# Altium schematic sheet OurEDA-P1K_Network.SchDoc
size A4; SheetNumber: 2; SheetTotal: 7
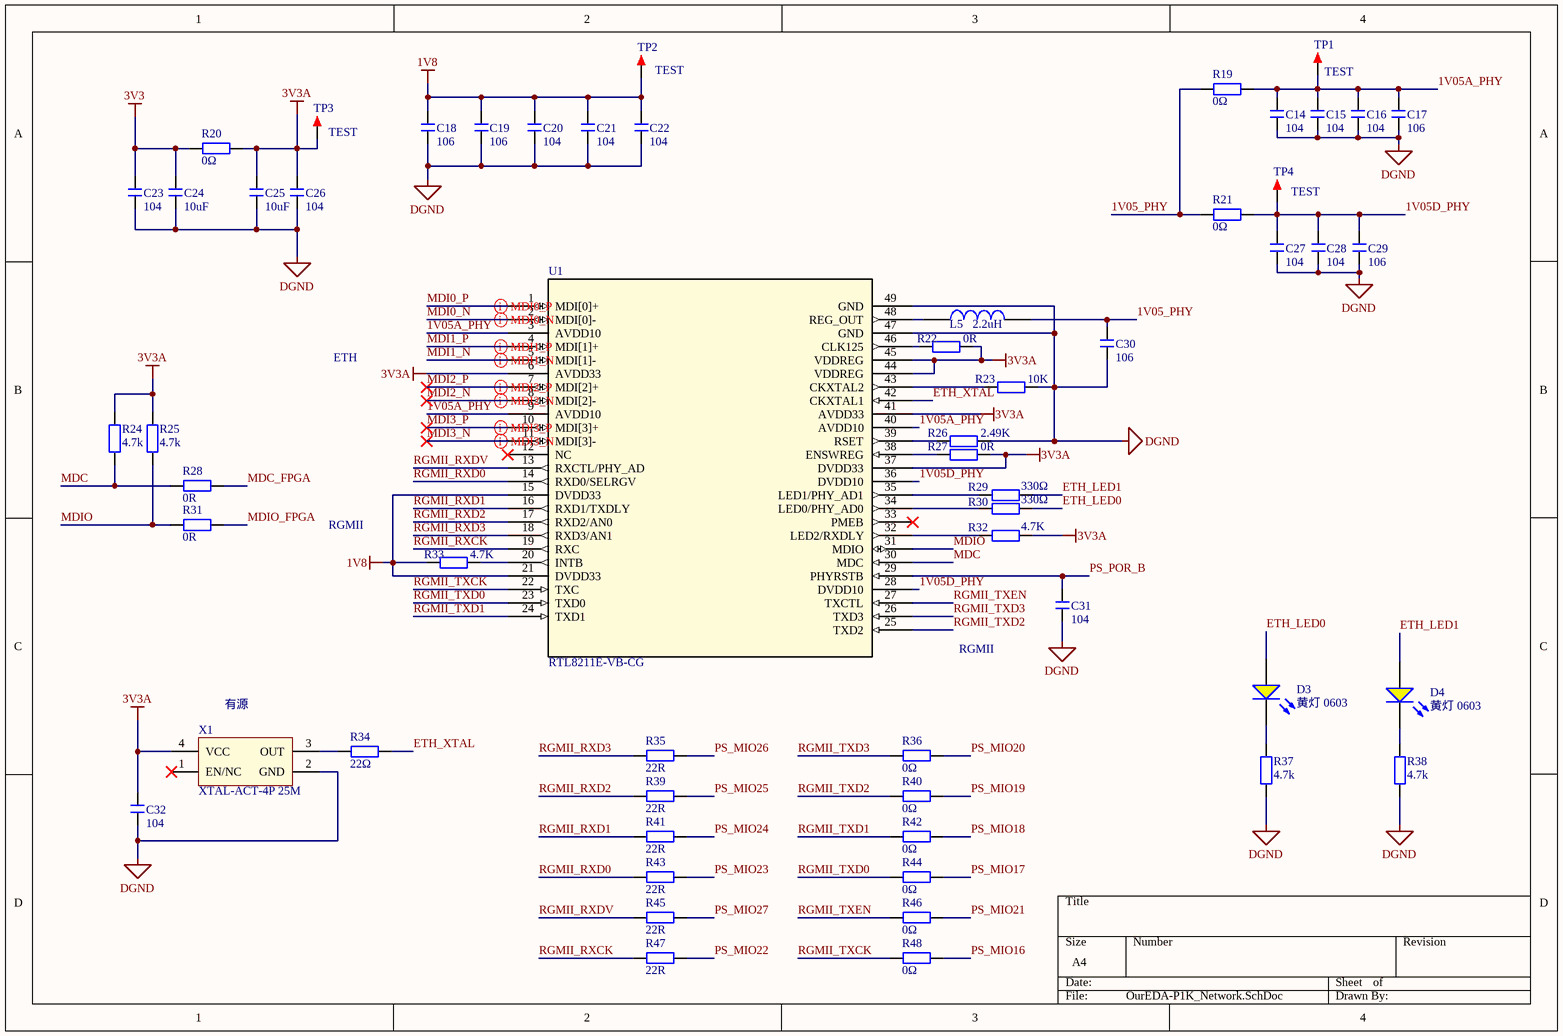
[diagram p0: OurEDA-P1K_Network.SchDoc]

## Parts
C14  104  [C 0603_L]
C15  104  [C 0603_L]
C16  104  [C 0603_L]
C17  106  [C 0603_L]
C18  106  [C 0603_L]
C19  106  [C 0603_L]
C20  104  [C 0603_L]
C21  104  [C 0603_L]
C22  104  [C 0603_L]
C23  104  [C 0603_L]
C24  10uF  [C 0603_L]
C25  10uF  [C 0603_L]
C26  104  [C 0603_L]
C27  104  [C 0603_L]
C28  104  [C 0603_L]
C29  106  [C 0603_L]
C30  106  [C 0603_L]
C31  104  [C 0603_L]
C32  104  [C 0603_L]
D3  黄灯 0603  [0603_LED_S1]
D4  黄灯 0603  [0603_LED_S1]
L5  2.2uH  [0805L]
R19  0Ω  [R 0603_L]
R20  0Ω  [R 0805_L]
R21  0Ω  [R 0603_L]
R22  0R  [R 0603_L]
R23  10K  [R 0603_L]
R24  4.7k  [R 0603_L]
R25  4.7k  [R 0603_L]
R26  2.49K  [R 0603_L]
R27  0R  [R 0603_L]
R28  0R  [R 0603_L]
R29  330Ω  [R 0603_L]
R30  330Ω  [R 0603_L]
R31  0R  [R 0603_L]
R32  4.7K  [R 0603_L]
R33  4.7K  [R 0603_L]
R34  22Ω  [R 0603_L]
R35  22R  [R 0603_L]
R36  0Ω  [R 0603_L]
R37  4.7k  [R 0603_L]
R38  4.7k  [R 0603_L]
R39  22R  [R 0603_L]
R40  0Ω  [R 0603_L]
R41  22R  [R 0603_L]
R42  0Ω  [R 0603_L]
R43  22R  [R 0603_L]
R44  0Ω  [R 0603_L]
R45  22R  [R 0603_L]
R46  0Ω  [R 0603_L]
R47  22R  [R 0603_L]
R48  0Ω  [R 0603_L]
TP1  TEST  [TEST 1]
TP2  TEST  [TEST 1]
TP3  TEST  [TEST 1]
TP4  TEST  [TEST 1]
U1  RTL8211E-VB-CG  [QFN48 6X6]
X1  XTAL-ACT-4P 25M  [OSC 1612-4P]

## Nets
1V8: C18.2 C19.2 C20.2 C21.2 C22.2 R33.2 TP2.1 U1.15(DVDD33) U1.21(DVDD33)
3V3: C23.2 C24.2 R20.1
3V3A: C25.2 C26.2 C32.2 R20.2 R22.1 R24.1 R25.1 R27.1 R32.1 TP3.1 U1.6(AVDD33) U1.37(DVDD33) U1.41(AVDD33) U1.44(VDDREG) U1.45(VDDREG) X1.4(VCC)
DGND: C14.1 C15.1 C16.1 C17.1 C18.1 C19.1 C20.1 C21.1 C22.1 C23.1 C24.1 C25.1 C26.1 C27.1 C28.1 C29.1 C30.2 C31.2 C32.1 R23.1 R26.1 R37.1 R38.1 U1.47(GND) U1.49(GND) X1.2(GND)
1V05_PHY: C30.1 L5.2 R19.1 R21.1
1V05A_PHY: C14.2 C15.2 C16.2 C17.2 R19.2 TP1.1 U1.3(AVDD10) U1.9(AVDD10) U1.40(AVDD10)
1V05D_PHY: C27.2 C28.2 C29.2 R21.2 TP4.1 U1.28(DVDD10) U1.36(DVDD10)
ETH_LED0: D3.A R30.1
ETH_LED1: D4.A R29.1
ETH_XTAL: R34.2 U1.42(CKXTAL1)
MDC: R24.2 R28.2 U1.30(MDC)
MDC_FPGA: R28.1
MDI0_N: U1.2(MDI[0]-)
MDI0_P: U1.1(MDI[0]+)
MDI1_N: U1.5(MDI[1]-)
MDI1_P: U1.4(MDI[1]+)
MDI2_N: U1.8(MDI[2]-)
MDI2_P: U1.7(MDI[2]+)
MDI3_N: U1.11(MDI[3]-)
MDI3_P: U1.10(MDI[3]+)
MDIO: R25.2 R31.2 U1.31(MDIO)
MDIO_FPGA: R31.1
PS_MIO16: R48.2
PS_MIO17: R44.2
PS_MIO18: R42.2
PS_MIO19: R40.2
PS_MIO20: R36.2
PS_MIO21: R46.2
PS_MIO22: R47.2
PS_MIO23: R43.2
PS_MIO24: R41.2
PS_MIO25: R39.2
PS_MIO26: R35.2
PS_MIO27: R45.2
PS_POR_B: C31.1 U1.29(PHYRSTB)
RGMII_RXCK: R47.1 U1.19(RXC)
RGMII_RXD0: R43.1 U1.14(RXD0/SELRGV)
RGMII_RXD1: R41.1 U1.16(RXD1/TXDLY)
RGMII_RXD2: R39.1 U1.17(RXD2/AN0)
RGMII_RXD3: R35.1 U1.18(RXD3/AN1)
RGMII_RXDV: R45.1 U1.13(RXCTL/PHY_AD)
RGMII_TXCK: R48.1 U1.22(TXC)
RGMII_TXD0: R44.1 U1.23(TXD0)
RGMII_TXD1: R42.1 U1.24(TXD1)
RGMII_TXD2: R40.1 U1.25(TXD2)
RGMII_TXD3: R36.1 U1.26(TXD3)
RGMII_TXEN: R46.1 U1.27(TXCTL)
NetD3_K: D3.K R37.2
NetD4_K: D4.K R38.2
NetL5_1: L5.1 U1.48(REG_OUT)
NetR22_2: R22.2 U1.46(CLK125)
NetR23_2: R23.2 U1.43(CKXTAL2)
NetR26_2: R26.2 U1.39(RSET)
NetR27_2: R27.2 U1.38(ENSWREG)
NetR29_2: R29.2 U1.35(LED1/PHY_AD1)
NetR30_2: R30.2 U1.34(LED0/PHY_AD0)
NetR32_2: R32.2 U1.32(LED2/RXDLY)
NetR33_1: R33.1 U1.20(INTB)
NetR34_1: R34.1 X1.3(OUT)

Not connected (* = marked no-connect by the designer): U1 12(NC)* 33(PMEB)*; X1 1(EN/NC)*

## Layout directives
differential pair: MDI0_N, MDI0_P, MDI1_N, MDI1_P, MDI2_N, MDI2_P, MDI3_N, MDI3_P

## Notes on the sheet
- ETH
- RGMII
- (near X1) 有源

## Library data of the parts
C14-C32 = C: 无极性贴片电容; 版权归属: 源创客; BOM名称: 无极性贴片电容; 学习资源: www.ooocke.com
D3 D4 = 0603 黄灯: 发光二极管; ComponentLink1Description: 供应商链接; ComponentLink1URL: http://www.szlcsc.com/product/details_73147.html; Package: 0603; Supplier: LC; SuppliersPartNumber: C72038
L5 = INDUCTOR
R19-R48 = R: 贴片电阻; 版权归属: 源创客; BOM名称: 贴片电阻; 学习资源: www.ooocke.com
TP1-TP4 = TEST: 测试点; 版权归属: 源创客; BOM名称: 测试点; 学习资源: www.ooocke.com
U1 = RTL8211E-VB-CG: No Description Available; Mfr_Name: Realtek; Copyright: Copyright (C) 2022 Ultra Librarian. All rights reserved.; Manufacturer_Part_Number: RTL8211E-VB-CG; RefDes: RefDes; Type: DEV
X1 = XTAL-ACT-4P: 4脚有源晶振